# Altium schematic sheet POWER.SchDoc
size A4; SheetNumber: 2; SheetTotal: 2
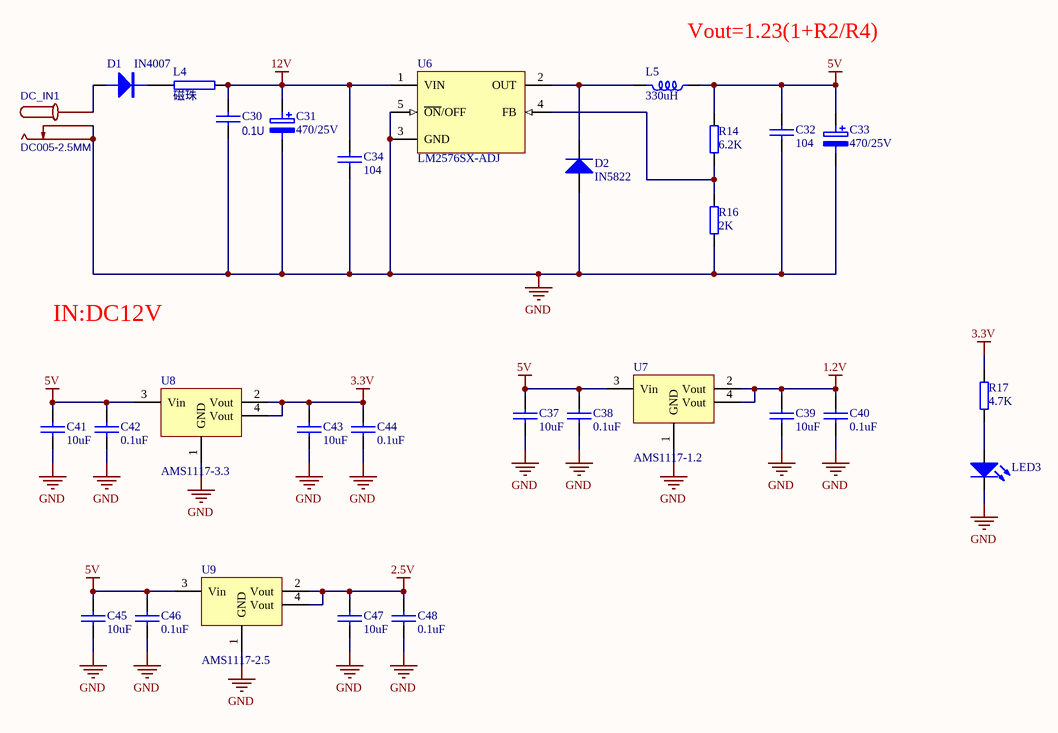
[diagram p0: POWER.SchDoc]

## Parts
C30  0.1U  [0805]
C31  470/25V  [电容 铝电解 470U/35V]
C32  104  [0805]
C33  470/25V  [电容 铝电解 470U/35V]
C34  104  [0805]
C37  10uF  [0805]
C38  0.1uF  [0805]
C39  10uF  [0805]
C40  0.1uF  [0805]
C41  10uF  [0805]
C42  0.1uF  [0805]
C43  10uF  [0805]
C44  0.1uF  [0805]
C45  10uF  [0805]
C46  0.1uF  [0805]
C47  10uF  [0805]
C48  0.1uF  [0805]
D1  IN4007  [二极管 贴片 4007]
D2  IN5822  [二极管 贴片 4007]
DC_IN1  DC005-2.5MM  [DC005-2.5MM]
L4  磁珠  [0805]
L5  330uH  [电感 贴片 12*12]
LED3  (no value)  [LED0805]
R14  6.2K  [0805]
R16  2K  [0805]
R17  4.7K  [0805]
U6  LM2576SX-ADJ  [TO263 LM2576]
U7  AMS1117-1.2  [SOT223]
U8  AMS1117-3.3  [SOT223]
U9  AMS1117-2.5  [SOT223]

## Nets
1.2V: C39.2 C40.2 U7.2(Vout) U7.4(Vout)
2.5V: C47.2 C48.2 U9.2(Vout) U9.4(Vout)
3.3V: C43.2 C44.2 R17.1 U8.2(Vout) U8.4(Vout)
5V: C32.2 C33.1 C37.2 C38.2 C41.2 C42.2 C45.2 C46.2 L5.2 R14.1 U7.3(Vin) U8.3(Vin) U9.3(Vin)
12V: C30.2 C31.1 C34.2 L4.1 U6.1(VIN)
GND: C30.1 C31.2 C32.1 C33.2 C34.1 C37.1 C38.1 C39.1 C40.1 C41.1 C42.1 C43.1 C44.1 C45.1 C46.1 C47.1 C48.1 D2.1(A) DC_IN1.2 DC_IN1.3 LED3.2(K) R16.2 U6.3(GND) U6.5(~{ON}/OFF) U7.1(GND) U8.1(GND) U9.1(GND)
NetD1_1: D1.1 DC_IN1.1
NetD1_2: D1.2 L4.2
NetD2_2: D2.2(K) L5.1 U6.2(OUT)
NetLED3_1: LED3.1(A) R17.2
NetR14_2: R14.2 R16.1 U6.4(FB)

## Notes on the sheet
- (near L5) Vout=1.23(1+R2/R4)
- IN:DC12V

## Library data of the parts
C30 = CAP
C31 C33 = 电容 贴片 铝电解 470u/25V: 名称: 贴片铝电解电容; 封装: 贴片; 单位: 个
C32 C34 C37-C48 = 电容 贴片 0805: 名称: 贴片电容; 单位: 个; 封装: 0805
D1 = DIODE
D2 = 二极管 贴片4007: 名称: 贴片二极管; 封装: 贴片; 单位: 个
DC_IN1 = DC005-2.5MM: BOM_Manufacturer: SOFNG(硕方); BOM_Manufacturer Part: DC005-T25; BOM_Supplier: LCSC; BOM_Supplier Part: C111573; BOM_JLCPCB Part Class: Extended Part; spicePre: D; spiceSymbolName: DC005-2.5MM
L4 = RES2
L5 = 电感 贴片 0805: 名称: 贴片电感; 封装: 0805; 单位: 个
LED3 = 二极管 贴片发光 0805: 名称: 贴片发光二极管; 封装: 0805; 单位: 个
R14 R16 R17 = 电阻 贴片 0805: 名称: 贴片电阻; 单位: 个; 封装: 0805
U6 = LM2576SX-5.0: DC-DC芯片; ComponentLink1Description: 供应商链接; ComponentLink1URL: http://www.szlcsc.com/product/details_35434.html; Package: TO-263-5; Supplier: LC; SuppliersPartNumber: C34465
U7-U9 = 贴片芯片 SPX1117M3-3.3: LDO; 名称: 贴片芯片; 单位: 个; 封装: SOT223